# Altium schematic sheet minibot_v1.SchDoc
size A; SheetNumber: 1; SheetTotal: 4
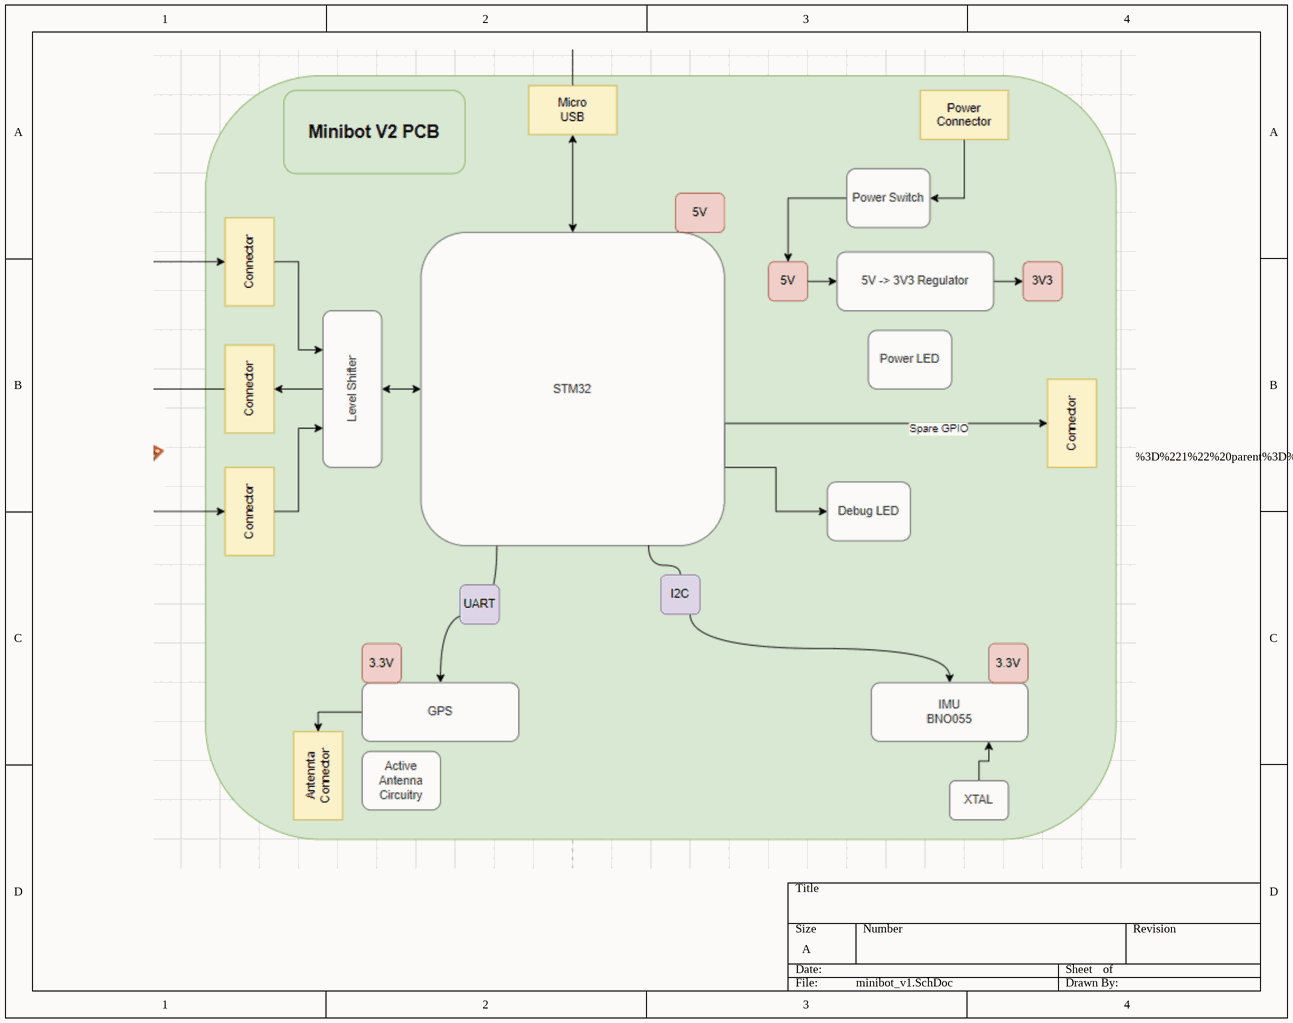
[diagram p0: minibot_v1.SchDoc]

## Notes on the sheet
- %3CmxGraphModel%3E%3Croot%3E%3CmxCell%20id%3D%220%22%2F%3E%3CmxCell%20id%3D%221%22%20parent%3D%220%22%2F%3E%3CmxCell%20id%3D%222%22%20value%3D%22%22%20style%3D%22rounded%3D1%3BwhiteSpace%3Dwrap%3Bhtml%3D1%3BfillColor%3D%23d5e8d4%3BstrokeColor%3D%2382b366%3BarcSize%3D15%3B%22%20vertex%3D%221%22%20parent%3D%221%22%3E%3CmxGeometry%20x%3D%22-375%22%20y%3D%22-820%22%20width%3D%22930%22%20height%3D%22780%22%20as%3D%22geometry%22%2F%3E%3C%2FmxCell%3E%3CmxCell%20id%3D%223%22%20style%3D%22edgeStyle%3DorthogonalEdgeStyle%3Bcurved%3D1%3BorthogonalLoop%3D1%3BjettySize%3Dauto%3Bhtml%3D1%3BexitX%3D0.25%3BexitY%3D1%3BexitDx%3D0%3BexitDy%3D0%3B%22%20edge%3D%221%22%20source%3D%229%22%20target%3D%2213%22%20parent%3D%221%22%3E%3CmxGeometry%20relative%3D%221%22%20as%3D%22geometry%22%2F%3E%3C%2FmxCell%3E%3CmxCell%20id%3D%224%22%20style%3D%22edgeStyle%3DorthogonalEdgeStyle%3Bcurved%3D1%3BorthogonalLoop%3D1%3BjettySize%3Dauto%3Bhtml%3D1%3BexitX%3D0.75%3BexitY%3D1%3BexitDx%3D0%3BexitDy%3D0%3BentryX%3D0.5%3BentryY%3D0%3BentryDx%3D0%3BentryDy%3D0%3BstartArrow%3Dnone%3B%22%20edge%3D%221%22%20source%3D%2243%22%20target%3D%2211%22%20parent%3D%221%22%3E%3CmxGeometry%20relative%3D%221%22%20as%3D%22geometry%22%2F%3E%3C%2FmxCell%3E%3CmxCell%20id%3D%225%22%20style%3D%22edgeStyle%3DorthogonalEdgeStyle%3Brounded%3D0%3BorthogonalLoop%3D1%3BjettySize%3Dauto%3Bhtml%3D1%3BexitX%3D0.5%3BexitY%3D0%3BexitDx%3D0%3BexitDy%3D0%3BentryX%3D0.5%3BentryY%3D1%3BentryDx%3D0%3BentryDy%3D0%3BstartArrow%3Dclassic%3BstartFill%3D1%3B%22%20edge%3D%221%22%20source%3D%229%22%20target%3D%2218%22%20parent%3D%221%22%3E%3CmxGeometry%20relative%3D%221%22%20as%3D%22geometry%22%2F%3E%3C%2FmxCell%3E%3CmxCell%20id%3D%226%22%20style%3D%22edgeStyle%3DorthogonalEdgeStyle%3Brounded%3D0%3BorthogonalLoop%3D1%3BjettySize%3Dauto%3Bhtml%3D1%3BexitX%3D1%3BexitY%3D0.75%3BexitDx%3D0%3BexitDy%3D0%3BentryX%3D0.5%3BentryY%3D0%3BentryDx%3D0%3BentryDy%3D0%3BstartArrow%3Dnone%3BstartFill%3D0%3B%22%20edge%3D%221%22%20source%3D%229%22%20target%3D%2237%22%20parent%3D%221%22%3E%3CmxGeometry%20relative%3D%221%22%20as%3D%22geometry%22%3E%3CArray%20as%3D%22points%22%3E%3CmxPoint%20x%3D%22155%22%20y%3D%22-465%22%2F%3E%3C%2FArray%3E%3C%2FmxGeometry%3E%3C%2FmxCell%3E%3CmxCell%20id%3D%227%22%20value%3D%22Spare%20GPIO%22%20style%3D%22edgeLabel%3Bhtml%3D1%3Balign%3Dcenter%3BverticalAlign%3Dmiddle%3Bresizable%3D0%3Bpoints%3D%5B%5D%3B%22%20connectable%3D%220%22%20vertex%3D%221%22%20parent%3D%226%22%3E%3CmxGeometry%20x%3D%220.3987%22%20y%3D%22-5%22%20relative%3D%221%22%20as%3D%22geometry%22%3E%3CmxPoint%20as%3D%22offset%22%2F%3E%3C%2FmxGeometry%3E%3C%2FmxCell%3E%3CmxCell%20id%3D%228%22%20style%3D%22edgeStyle%3DorthogonalEdgeStyle%3Brounded%3D0%3BorthogonalLoop%3D1%3BjettySize%3Dauto%3Bhtml%3D1%3BexitX%3D1%3BexitY%3D0.75%3BexitDx%3D0%3BexitDy%3D0%3B%22%20edge%3D%221%22%20source%3D%229%22%20target%3D%2239%22%20parent%3D%221%22%3E%3CmxGeometry%20relative%3D%221%22%20as%3D%22geometry%22%2F%3E%3C%2FmxCell%3E%3CmxCell%20id%3D%229%22%20value%3D%22STM32%22%20style%3D%22rounded%3D1%3BwhiteSpace%3Dwrap%3Bhtml%3D1%3BfillColor%3D%23f5f5f5%3BfontColor%3D%23333333%3BstrokeColor%3D%23666666%3B%22%20vertex%3D%221%22%20parent%3D%221%22%3E%3CmxGeometry%20x%3D%22-155%22%20y%3D%22-660%22%20width%3D%22310%22%20height%3D%22320%22%20as%3D%22geometry%22%2F%3E%3C%2FmxCell%3E%3CmxCell%20id%3D%2210%22%20value%3D%225V%22%20style%3D%22rounded%3D1%3BwhiteSpace%3Dwrap%3Bhtml%3D1%3BfillColor%3D%23f8cecc%3BstrokeColor%3D%23b85450%3B%22%20vertex%3D%221%22%20parent%3D%221%22%3E%3CmxGeometry%20x%3D%22105%22%20y%3D%22-700%22%20width%3D%2250%22%20height%3D%2240%22%20as%3D%22geometry%22%2F%3E%3C%2FmxCell%3E%3CmxCell%20id%3D%2211%22%20value%3D%22IMU%26lt%3Bbr%26gt%3BBNO055%22%20style%3D%22rounded%3D1%3BwhiteSpace%3Dwrap%3Bhtml%3D1%3BfillColor%3D%23f5f5f5%3BfontColor%3D%23333333%3BstrokeColor%3D%23666666%3B%22%20vertex%3D%221%22%20parent%3D%221%22%3E%3CmxGeometry%20x%3D%22305%22%20y%3D%22-200%22%20width%3D%22160%22%20height%3D%2260%22%20as%3D%22geometry%22%2F%3E%3C%2FmxCell%3E%3CmxCell%20id%3D%2212%22%20style%3D%22edgeStyle%3DorthogonalEdgeStyle%3Brounded%3D0%3BorthogonalLoop%3D1%3BjettySize%3Dauto%3Bhtml%3D1%3BexitX%3D0%3BexitY%3D0.5%3BexitDx%3D0%3BexitDy%3D0%3BentryX%3D1%3BentryY%3D0.5%3BentryDx%3D0%3BentryDy%3D0%3BstartArrow%3Dnone%3BstartFill%3D0%3B%22%20edge%3D%221%22%20source%3D%2213%22%20target%3D%2236%22%20parent%3D%221%22%3E%3CmxGeometry%20relative%3D%221%22%20as%3D%22geometry%22%2F%3E%3C%2FmxCell%3E%3CmxCell%20id%3D%2213%22%20value%3D%22GPS%22%20style%3D%22rounded%3D1%3BwhiteSpace%3Dwrap%3Bhtml%3D1%3BfillColor%3D%23f5f5f5%3BfontColor%3D%23333333%3BstrokeColor%3D%23666666%3B%22%20vertex%3D%221%22%20parent%3D%221%22%3E%3CmxGeometry%20x%3D%22-215%22%20y%3D%22-200%22%20width%3D%22160%22%20height%3D%2260%22%20as%3D%22geometry%22%2F%3E%3C%2FmxCell%3E%3CmxCell%20id%3D%2214%22%20value%3D%22UART%22%20style%3D%22rounded%3D1%3BwhiteSpace%3Dwrap%3Bhtml%3D1%3BfillColor%3D%23e1d5e7%3BstrokeColor%3D%239673a6%3B%22%20vertex%3D%221%22%20parent%3D%221%22%3E%3CmxGeometry%20x%3D%22-115%22%20y%3D%22-300%22%20width%3D%2240%22%20height%3D%2240%22%20as%3D%22geometry%22%2F%3E%3C%2FmxCell%3E%3CmxCell%20id%3D%2215%22%20value%3D%223.3V%22%20style%3D%22rounded%3D1%3BwhiteSpace%3Dwrap%3Bhtml%3D1%3BfillColor%3D%23f8cecc%3BstrokeColor%3D%23b85450%3B%22%20vertex%3D%221%22%20parent%3D%221%22%3E%3CmxGeometry%20x%3D%22425%22%20y%3D%22-240%22%20width%3D%2240%22%20height%3D%2240%22%20as%3D%22geometry%22%2F%3E%3C%2FmxCell%3E%3CmxCell%20id%3D%2216%22%20value%3D%223.3V%22%20style%3D%22rounded%3D1%3BwhiteSpace%3Dwrap%3Bhtml%3D1%3BfillColor%3D%23f8cecc%3BstrokeColor%3D%23b85450%3B%22%20vertex%3D%221%22%20parent%3D%221%22%3E%3CmxGeometry%20x%3D%22-215%22%20y%3D%22-240%22%20width%3D%2240%22%20height%3D%2240%22%20as%3D%22geometry%22%2F%3E%3C%2FmxCell%3E%3CmxCell%20id%3D%2217%22%20value%3D%22Connector%22%20style%3D%22rounded%3D0%3BwhiteSpace%3Dwrap%3Bhtml%3D1%3Brotation%3D-90%3BfillColor%3D%23fff2cc%3BstrokeColor%3D%23d6b656%3B%22%20vertex%3D%221%22%20parent%3D%221%22%3E%3CmxGeometry%20x%3D%22-375%22%20y%3D%22-525%22%20width%3D%2290%22%20height%3D%2250%22%20as%3D%22geometry%22%2F%3E%3C%2FmxCell%3E%3CmxCell%20id%3D%2218%22%20value%3D%22Micro%20%26lt%3Bbr%26gt%3BUSB%22%20style%3D%22rounded%3D0%3BwhiteSpace%3Dwrap%3Bhtml%3D1%3Brotation%3D0%3BfillColor%3D%23fff2cc%3BstrokeColor%3D%23d6b656%3B%22%20vertex%3D%221%22%20parent%3D%221%22%3E%3CmxGeometry%20x%3D%22-45%22%20y%3D%22-810%22%20width%3D%2290%22%20height%3D%2250%22%20as%3D%22geometry%22%2F%3E%3C%2FmxCell%3E%3CmxCell%20id%3D%2219%22%20style%3D%22edgeStyle%3DorthogonalEdgeStyle%3Brounded%3D0%3BorthogonalLoop%3D1%3BjettySize%3Dauto%3Bhtml%3D1%3BexitX%3D0.5%3BexitY%3D1%3BexitDx%3D0%3BexitDy%3D0%3BentryX%3D1%3BentryY%3D0.5%3BentryDx%3D0%3BentryDy%3D0%3B%22%20edge%3D%221%22%20source%3D%2220%22%20target%3D%2241%22%20parent%3D%221%22%3E%3CmxGeometry%20relative%3D%221%22%20as%3D%22geometry%22%2F%3E%3C%2FmxCell%3E%3CmxCell%20id%3D%2220%22%20value%3D%22Power%20Connector%22%20style%3D%22rounded%3D0%3BwhiteSpace%3Dwrap%3Bhtml%3D1%3Brotation%3D0%3BfillColor%3D%23fff2cc%3BstrokeColor%3D%23d6b656%3B%22%20vertex%3D%221%22%20parent%3D%221%22%3E%3CmxGeometry%20x%3D%22355%22%20y%3D%22-805%22%20width%3D%2290%22%20height%3D%2250%22%20as%3D%22geometry%22%2F%3E%3C%2FmxCell%3E%3CmxCell%20id%3D%2221%22%20style%3D%22edgeStyle%3DorthogonalEdgeStyle%3Brounded%3D0%3BorthogonalLoop%3D1%3BjettySize%3Dauto%3Bhtml%3D1%3BexitX%3D0.5%3BexitY%3D1%3BexitDx%3D0%3BexitDy%3D0%3BentryX%3D0.75%3BentryY%3D0%3BentryDx%3D0%3BentryDy%3D0%3B%22%20edge%3D%221%22%20source%3D%2222%22%20target%3D%2227%22%20parent%3D%221%22%3E%3CmxGeometry%20relative%3D%221%22%20as%3D%22geometry%22%2F%3E%3C%2FmxCell%3E%3CmxCell%20id%3D%2222%22%20value%3D%22Connector%22%20style%3D%22rounded%3D0%3BwhiteSpace%3Dwrap%3Bhtml%3D1%3Brotation%3D-90%3BfillColor%3D%23fff2cc%3BstrokeColor%3D%23d6b656%3B%22%20vertex%3D%221%22%20parent%3D%221%22%3E%3CmxGeometry%20x%3D%22-375%22%20y%3D%22-655%22%20width%3D%2290%22%20height%3D%2250%22%20as%3D%22geometry%22%2F%3E%3C%2FmxCell%3E%3CmxCell%20id%3D%2223%22%20style%3D%22edgeStyle%3DorthogonalEdgeStyle%3Brounded%3D0%3BorthogonalLoop%3D1%3BjettySize%3Dauto%3Bhtml%3D1%3BentryX%3D0.25%3BentryY%3D0%3BentryDx%3D0%3BentryDy%3D0%3B%22%20edge%3D%221%22%20source%3D%2224%22%20target%3D%2227%22%20parent%3D%221%22%3E%3CmxGeometry%20relative%3D%221%22%20as%3D%22geometry%22%2F%3E%3C%2FmxCell%3E%3CmxCell%20id%3D%2224%22%20value%3D%22Connector%22%20style%3D%22rounded%3D0%3BwhiteSpace%3Dwrap%3Bhtml%3D1%3Brotation%3D-90%3BfillColor%3D%23fff2cc%3BstrokeColor%3D%23d6b656%3B%22%20vertex%3D%221%22%20parent%3D%221%22%3E%3CmxGeometry%20x%3D%22-375%22%20y%3D%22-400%22%20width%3D%2290%22%20height%3D%2250%22%20as%3D%22geometry%22%2F%3E%3C%2FmxCell%3E%3CmxCell%20id%3D%2225%22%20style%3D%22edgeStyle%3DorthogonalEdgeStyle%3Brounded%3D0%3BorthogonalLoop%3D1%3BjettySize%3Dauto%3Bhtml%3D1%3BexitX%3D0.5%3BexitY%3D0%3BexitDx%3D0%3BexitDy%3D0%3B%22%20edge%3D%221%22%20source%3D%2227%22%20target%3D%2217%22%20parent%3D%221%22%3E%3CmxGeometry%20relative%3D%221%22%20as%3D%22geometry%22%2F%3E%3C%2FmxCell%3E%3CmxCell%20id%3D%2226%22%20style%3D%22edgeStyle%3DorthogonalEdgeStyle%3Brounded%3D0%3BorthogonalLoop%3D1%3BjettySize%3Dauto%3Bhtml%3D1%3BexitX%3D0.5%3BexitY%3D1%3BexitDx%3D0%3BexitDy%3D0%3BentryX%3D0%3BentryY%3D0.5%3BentryDx%3D0%3BentryDy%3D0%3BstartArrow%3Dclassic%3BstartFill%3D1%3B%22%20edge%3D%221%22%20source%3D%2227%22%20target%3D%229%22%20parent%3D%221%22%3E%3CmxGeometry%20relative%3D%221%22%20as%3D%22geometry%22%3E%3CArray%20as%3D%22points%22%3E%3CmxPoint%20x%3D%22-185%22%20y%3D%22-500%22%2F%3E%3CmxPoint%20x%3D%22-185%22%20y%3D%22-500%22%2F%3E%3C%2FArray%3E%3C%2FmxGeometry%3E%3C%2FmxCell%3E%3CmxCell%20id%3D%2227%22%20value%3D%22Level%20Shifter%22%20style%3D%22rounded%3D1%3BwhiteSpace%3Dwrap%3Bhtml%3D1%3BfillColor%3D%23f5f5f5%3BfontColor%3D%23333333%3BstrokeColor%3D%23666666%3Brotation%3D-90%3B%22%20vertex%3D%221%22%20parent%3D%221%22%3E%3CmxGeometry%20x%3D%22-305%22%20y%3D%22-530%22%20width%3D%22160%22%20height%3D%2260%22%20as%3D%22geometry%22%2F%3E%3C%2FmxCell%3E%3CmxCell%20id%3D%2228%22%20style%3D%22edgeStyle%3DorthogonalEdgeStyle%3Bcurved%3D1%3BorthogonalLoop%3D1%3BjettySize%3Dauto%3Bhtml%3D1%3BexitX%3D1%3BexitY%3D0.5%3BexitDx%3D0%3BexitDy%3D0%3BentryX%3D0%3BentryY%3D0.5%3BentryDx%3D0%3BentryDy%3D0%3B%22%20edge%3D%221%22%20source%3D%2229%22%20target%3D%2231%22%20parent%3D%221%22%3E%3CmxGeometry%20relative%3D%221%22%20as%3D%22geometry%22%2F%3E%3C%2FmxCell%3E%3CmxCell%20id%3D%2229%22%20value%3D%225V%22%20style%3D%22rounded%3D1%3BwhiteSpace%3Dwrap%3Bhtml%3D1%3BfillColor%3D%23f8cecc%3BstrokeColor%3D%23b85450%3B%22%20vertex%3D%221%22%20parent%3D%221%22%3E%3CmxGeometry%20x%3D%22200%22%20y%3D%22-630%22%20width%3D%2240%22%20height%3D%2240%22%20as%3D%22geometry%22%2F%3E%3C%2FmxCell%3E%3CmxCell%20id%3D%2230%22%20style%3D%22edgeStyle%3DorthogonalEdgeStyle%3Bcurved%3D1%3BorthogonalLoop%3D1%3BjettySize%3Dauto%3Bhtml%3D1%3BexitX%3D1%3BexitY%3D0.5%3BexitDx%3D0%3BexitDy%3D0%3BentryX%3D0%3BentryY%3D0.5%3BentryDx%3D0%3BentryDy%3D0%3B%22%20edge%3D%221%22%20source%3D%2231%22%20target%3D%2232%22%20parent%3D%221%22%3E%3CmxGeometry%20relative%3D%221%22%20as%3D%22geometry%22%2F%3E%3C%2FmxCell%3E%3CmxCell%20id%3D%2231%22%20value%3D%225V%20-%26amp%3Bgt%3B%203V3%20Regulator%22%20style%3D%22rounded%3D1%3BwhiteSpace%3Dwrap%3Bhtml%3D1%3BfillColor%3D%23f5f5f5%3BfontColor%3D%23333333%3BstrokeColor%3D%23666666%3B%22%20vertex%3D%221%22%20parent%3D%221%22%3E%3CmxGeometry%20x%3D%22270%22%20y%3D%22-640%22%20width%3D%22160%22%20height%3D%2260%22%20as%3D%22geometry%22%2F%3E%3C%2FmxCell%3E%3CmxCell%20id%3D%2232%22%20value%3D%223V3%22%20style%3D%22rounded%3D1%3BwhiteSpace%3Dwrap%3Bhtml%3D1%3BfillColor%3D%23f8cecc%3BstrokeColor%3D%23b85450%3B%22%20vertex%3D%221%22%20parent%3D%221%22%3E%3CmxGeometry%20x%3D%22460%22%20y%3D%22-630%22%20width%3D%2240%22%20height%3D%2240%22%20as%3D%22geometry%22%2F%3E%3C%2FmxCell%3E%3CmxCell%20id%3D%2233%22%20style%3D%22edgeStyle%3DorthogonalEdgeStyle%3Brounded%3D0%3BorthogonalLoop%3D1%3BjettySize%3Dauto%3Bhtml%3D1%3BexitX%3D0.5%3BexitY%3D0%3BexitDx%3D0%3BexitDy%3D0%3BentryX%3D0.75%3BentryY%3D1%3BentryDx%3D0%3BentryDy%3D0%3BstartArrow%3Dnone%3BstartFill%3D0%3B%22%20edge%3D%221%22%20source%3D%2234%22%20target%3D%2211%22%20parent%3D%221%22%3E%3CmxGeometry%20relative%3D%221%22%20as%3D%22geometry%22%2F%3E%3C%2FmxCell%3E%3CmxCell%20id%3D%2234%22%20value%3D%22XTAL%22%20style%3D%22rounded%3D1%3BwhiteSpace%3Dwrap%3Bhtml%3D1%3BfillColor%3D%23f5f5f5%3BfontColor%3D%23333333%3BstrokeColor%3D%23666666%3B%22%20vertex%3D%221%22%20parent%3D%221%22%3E%3CmxGeometry%20x%3D%22385%22%20y%3D%22-100%22%20width%3D%2260%22%20height%3D%2240%22%20as%3D%22geometry%22%2F%3E%3C%2FmxCell%3E%3CmxCell%20id%3D%2235%22%20value%3D%22Active%20Antenna%20Circuitry%22%20style%3D%22rounded%3D1%3BwhiteSpace%3Dwrap%3Bhtml%3D1%3BfillColor%3D%23f5f5f5%3BfontColor%3D%23333333%3BstrokeColor%3D%23666666%3B%22%20vertex%3D%221%22%20parent%3D%221%22%3E%3CmxGeometry%20x%3D%22-215%22%20y%3D%22-130%22%20width%3D%2280%22%20height%3D%2260%22%20as%3D%22geometry%22%2F%3E%3C%2FmxCell%3E%3CmxCell%20id%3D%2236%22%20value%3D%22Antennta%20Connector%22%20style%3D%22rounded%3D0%3BwhiteSpace%3Dwrap%3Bhtml%3D1%3Brotation%3D-90%3BfillColor%3D%23fff2cc%3BstrokeColor%3D%23d6b656%3B%22%20vertex%3D%221%22%20parent%3D%221%22%3E%3CmxGeometry%20x%3D%22-305%22%20y%3D%22-130%22%20width%3D%2290%22%20height%3D%2250%22%20as%3D%22geometry%22%2F%3E%3C%2FmxCell%3E%3CmxCell%20id%3D%2237%22%20value%3D%22Connector%22%20style%3D%22rounded%3D0%3BwhiteSpace%3Dwrap%3Bhtml%3D1%3Brotation%3D-90%3BfillColor%3D%23fff2cc%3BstrokeColor%3D%23d6b656%3B%22%20vertex%3D%221%22%20parent%3D%221%22%3E%3CmxGeometry%20x%3D%22465%22%20y%3D%22-490%22%20width%3D%2290%22%20height%3D%2250%22%20as%3D%22geometry%22%2F%3E%3C%2FmxCell%3E%3CmxCell%20id%3D%2238%22%20value%3D%22Power%20LED%22%20style%3D%22rounded%3D1%3BwhiteSpace%3Dwrap%3Bhtml%3D1%3BfillColor%3D%23f5f5f5%3BfontColor%3D%23333333%3BstrokeColor%3D%23666666%3B%22%20vertex%3D%221%22%20parent%3D%221%22%3E%3CmxGeometry%20x%3D%22302%22%20y%3D%22-560%22%20width%3D%2285%22%20height%3D%2260%22%20as%3D%22geometry%22%2F%3E%3C%2FmxCell%3E%3CmxCell%20id%3D%2239%22%20value%3D%22Debug%20LED%22%20style%3D%22rounded%3D1%3BwhiteSpace%3Dwrap%3Bhtml%3D1%3BfillColor%3D%23f5f5f5%3BfontColor%3D%23333333%3BstrokeColor%3D%23666666%3B%22%20vertex%3D%221%22%20parent%3D%221%22%3E%3CmxGeometry%20x%3D%22260%22%20y%3D%22-405%22%20width%3D%2285%22%20height%3D%2260%22%20as%3D%22geometry%22%2F%3E%3C%2FmxCell%3E%3CmxCell%20id%3D%2240%22%20style%3D%22edgeStyle%3DorthogonalEdgeStyle%3Brounded%3D0%3BorthogonalLoop%3D1%3BjettySize%3Dauto%3Bhtml%3D1%3BexitX%3D0%3BexitY%3D0.5%3BexitDx%3D0%3BexitDy%3D0%3BentryX%3D0.5%3BentryY%3D0%3BentryDx%3D0%3BentryDy%3D0%3B%22%20edge%3D%221%22%20source%3D%2241%22%20target%3D%2229%22%20parent%3D%221%22%3E%3CmxGeometry%20relative%3D%221%22%20as%3D%22geometry%22%2F%3E%3C%2FmxCell%3E%3CmxCell%20id%3D%2241%22%20value%3D%22Power%20Switch%22%20style%3D%22rounded%3D1%3BwhiteSpace%3Dwrap%3Bhtml%3D1%3BfillColor%3D%23f5f5f5%3BfontColor%3D%23333333%3BstrokeColor%3D%23666666%3B%22%20vertex%3D%221%22%20parent%3D%221%22%3E%3CmxGeometry%20x%3D%22280%22%20y%3D%22-725%22%20width%3D%2285%22%20height%3D%2260%22%20as%3D%22geometry%22%2F%3E%3C%2FmxCell%3E%3CmxCell%20id%3D%2242%22%20value%3D%22%22%20style%3D%22edgeStyle%3DorthogonalEdgeStyle%3Bcurved%3D1%3BorthogonalLoop%3D1%3BjettySize%3Dauto%3Bhtml%3D1%3BexitX%3D0.75%3BexitY%3D1%3BexitDx%3D0%3BexitDy%3D0%3BentryX%3D0.5%3BentryY%3D0%3BentryDx%3D0%3BentryDy%3D0%3BendArrow%3Dnone%3B%22%20edge%3D%221%22%20source%3D%229%22%20target%3D%2243%22%20parent%3D%221%22%3E%3CmxGeometry%20relative%3D%221%22%20as%3D%22geometry%22%3E%3CmxPoint%20x%3D%2277.5%22%20y%3D%22-340%22%20as%3D%22sourcePoint%22%2F%3E%3CmxPoint%20x%3D%22385%22%20y%3D%22-200%22%20as%3D%22targetPoint%22%2F%3E%3C%2FmxGeometry%3E%3C%2FmxCell%3E%3CmxCell%20id%3D%2243%22%20value%3D%22I2C%22%20style%3D%22rounded%3D1%3BwhiteSpace%3Dwrap%3Bhtml%3D1%3BfillColor%3D%23e1d5e7%3BstrokeColor%3D%239673a6%3B%22%20vertex%3D%221%22%20parent%3D%221%22%3E%3CmxGeometry%20x%3D%2290%22%20y%3D%22-310%22%20width%3D%2240%22%20height%3D%2240%22%20as%3D%22geometry%22%2F%3E%3C%2FmxCell%3E%3CmxCell%20id%3D%2244%22%20value%3D%22%26lt%3Bfont%20style%3D%26quot%3Bfont-size%3A%2018px%3B%26quot%3B%26gt%3B%26lt%3Bb%26gt%3BMinibot%20V2%20PCB%26lt%3B%2Fb%26gt%3B%26lt%3B%2Ffont%26gt%3B%22%20style%3D%22rounded%3D1%3BwhiteSpace%3Dwrap%3Bhtml%3D1%3BfillColor%3D%23d5e8d4%3BstrokeColor%3D%2382b366%3B%22%20vertex%3D%221%22%20parent%3D%221%22%3E%3CmxGeometry%20x%3D%22-295%22%20y%3D%22-805%22%20width%3D%22185%22%20height%3D%2285%22%20as%3D%22geometry%22%2F%3E%3C%2FmxCell%3E%3C%2Froot%3E%3C%2FmxGraphModel%3E